# EAGLE schematic Tracksoar v2  (EAGLE 9.0.0)
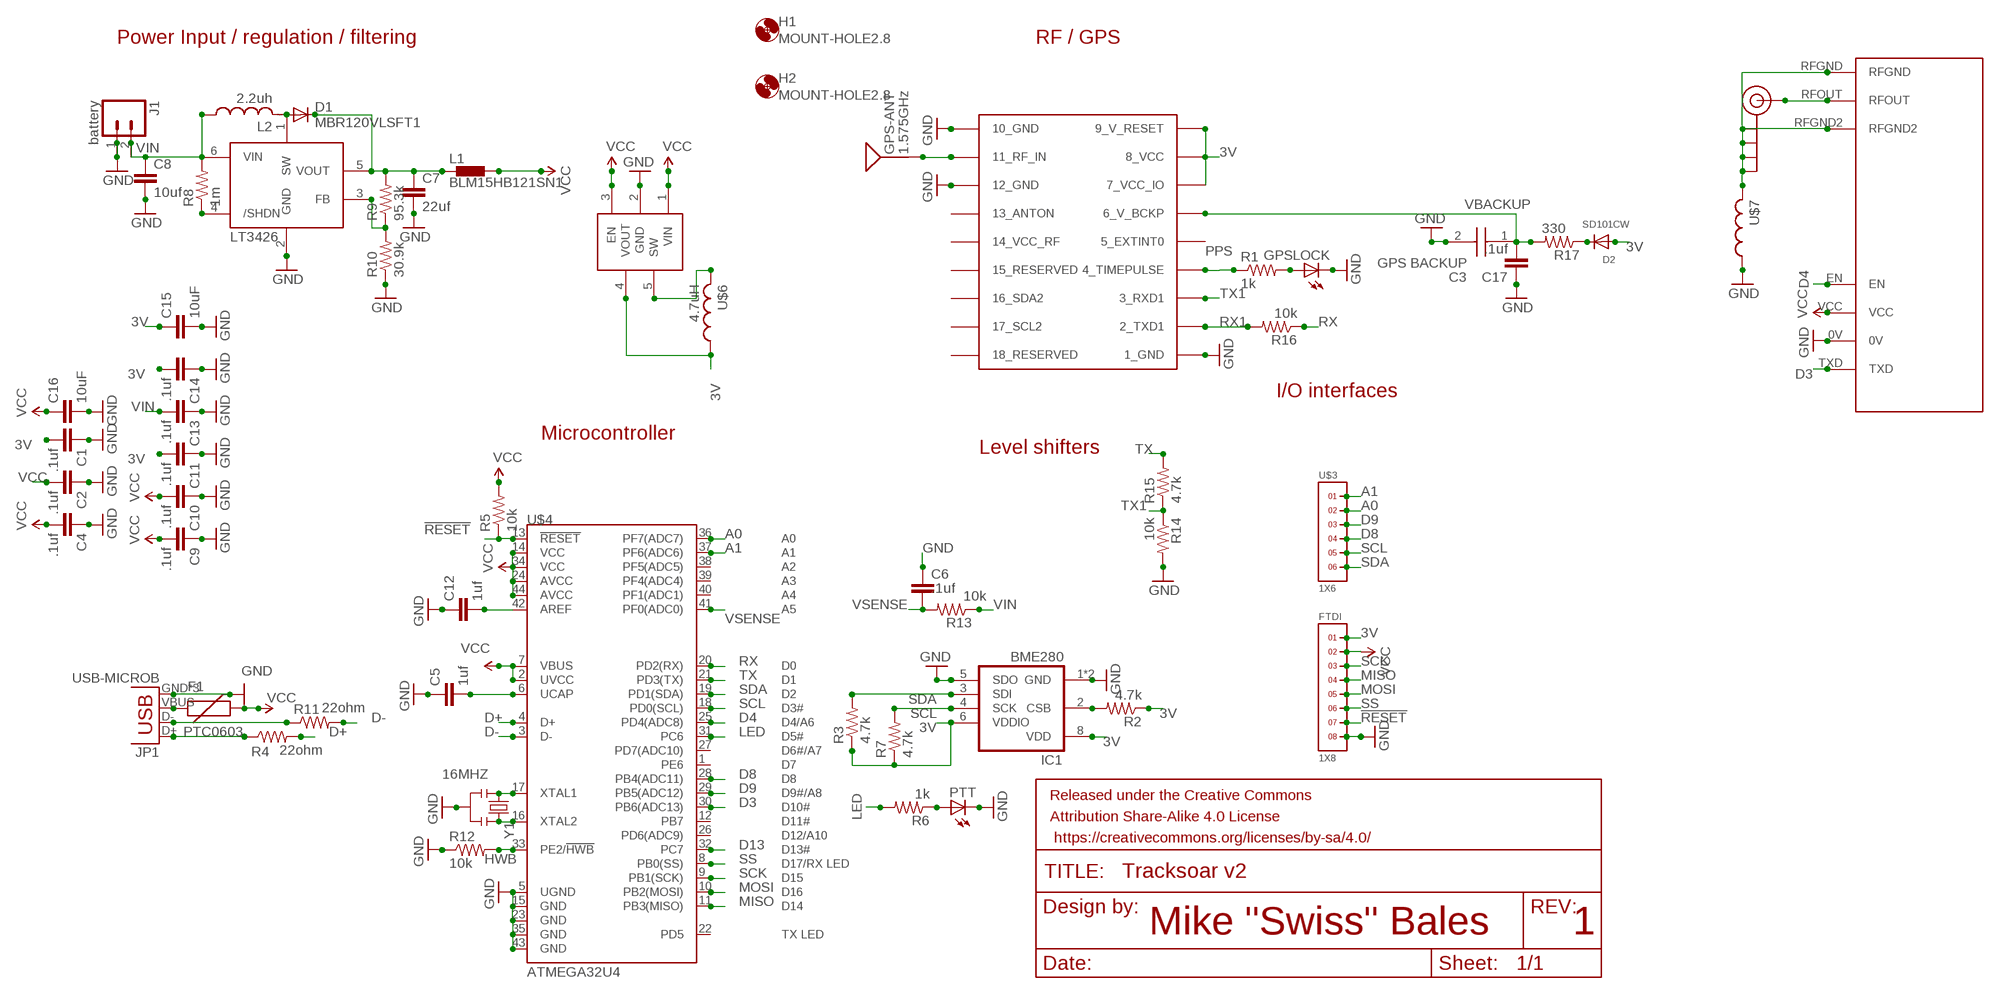
[diagram p0: schematic, sheet 1]

## Parts
C1  .1uf  CAP0402-CAP  [0402-CAP]
C2  .1uf  CAP0402-CAP  [0402-CAP]
C3  GPS BACKUP  DSK-3R3H204T614-H2L  [DSK-3R3H204T614-H2L]
C4  .1uf  CAP0402-CAP  [0402-CAP]
C5  1uf  CAP0402-CAP  [0402-CAP]
C6  .1uf  CAP0402-CAP  [0402-CAP]
C7  22uf  CAP0805  [0805]
C8  10uf  CAP0805  [0805]
C9  .1uf  CAP0402-CAP  [0402-CAP]
C10  .1uf  CAP0402-CAP  [0402-CAP]
C11  .1uf  CAP0402-CAP  [0402-CAP]
C12  1uf  CAP0402-CAP  [0402-CAP]
C13  .1uf  CAP0402-CAP  [0402-CAP]
C14  .1uf  CAP0402-CAP  [0402-CAP]
C15  10uF  10UF-0603-6.3V-20%  [0603]
C16  10uF  10UF-0603-6.3V-20%  [0603]
C17  .1uf  CAP0402-CAP  [0402-CAP]
D1  MBR120VLSFT1  DIODE-SOD123  [SOD123]
D2  SD101CW  DIODESOD-123  [SOD-123]
F1  PTC0603  [0603]
FRAME1  FRAME-LETTER  [CREATIVE_COMMONS]
FTDI  1X8  [1X8]
GPS-ANT  1.575GHz  ANTENNAGPS-2X7MM  [ANT-GPS-2X7MM]
GPSLOCK  LEDCHIP-LED0603  [CHIP-LED0603]
H1  MOUNT-HOLE2.8  [2,8]
H2  MOUNT-HOLE2.8  [2,8]
IC1  BME280  [BME280]
J1  battery  M02JST-PTH-2  [JST-2-PTH]
J$1  SMA_EDGE  [SMA-EDGE]
JP1  USB-MICROB  [USB-MICROB]
L1  BLM15HB121SN1  [0402]
L2  2.2uh  L-USL1812  [L1812]
LT3426  LT3426  [SOT23-6]
PTT  LEDCHIP-LED0603  [CHIP-LED0603]
R1  1k  R-US_R0402  [R0402]
R2  4.7k  R-US_R0402  [R0402]
R3  4.7k  R-US_R0402  [R0402]
R4  22ohm  R-US_R0402  [R0402]
R5  10k  R-US_R0402  [R0402]
R6  1k  R-US_R0402  [R0402]
R7  4.7k  R-US_R0402  [R0402]
R8  1m  R-US_R0402  [R0402]
R9  95.3k  R-US_R0402  [R0402]
R10  30.9k  R-US_R0402  [R0402]
R11  22ohm  R-US_R0402  [R0402]
R12  10k  R-US_R0402  [R0402]
R13  10k  R-US_R0402  [R0402]
R14  10k  R-US_R0402  [R0402]
R15  4.7k  R-US_R0402  [R0402]
R16  10k  R-US_R0402  [R0402]
R17  330  R-US_R0402  [R0402]
U$1  UBLOX_MAX  [UBLOX_MAX]
U$2  RADIOMETRIX-HX1  [RADIOMETRIX-HX1]
U$3  1X6  [1X6]
U$4  ATMEGA32U4  ATMEGA32U4QFN2  [QFN-44-NOPAD]
U$5  PAM2305  PAM2305-33SOT23-5  [DBV_R-PDSO-G5]
U$6  4.7uH  INDUCTOR_0805_N  [RESC0805_N]
U$7  INDUCTOR_0402_N  [RESC0402_N]
Y1  16MHZ  RESONATOR16MHZ  [RESONATOR-SMD]

## Nets
3V: C1.2 C11.2 C14.2 C15.1 D2.A FTDI.1 IC1.6(VDDIO) IC1.8(VDD) R2.1 R3.1 R7.1 U$1.7_VCC_IO U$1.8_VCC U$1.9_V_RESET U$5.4(VOUT) U$6.1
!RESET: FTDI.7 R5.1 U$4.13(!RESET)
A0: U$3.2 U$4.36(PF7(ADC7))
A1: U$3.1 U$4.37(PF6(ADC6))
D3: U$2.TXD U$4.30(PB6(ADC13))
D4: U$2.EN U$4.25(PD4(ADC8))
D8: U$3.4 U$4.28(PB4(ADC11))
D9: U$3.3 U$4.29(PB5(ADC12))
D13: U$4.32(PC7)
D+: R4.2 U$4.4(D+)
D-: R11.2 U$4.3(D-)
GND: C1.1 C2.1 C3.2(-) C4.1 C5.1 C6.1 C7.2 C8.2 C9.1 C10.1 C11.1 C12.1 C13.1 C14.1 C15.2 C16.2 C17.1 FTDI.8 GPSLOCK.C IC1.1(GND) IC1.5(SDO) IC1.7(GND) J1.1 JP1.GND JP1.MT1(GND) JP1.MT2(GND) LT3426.2(GND) PTT.C R10.1 R12.1 R14.2 U$1.1_GND U$1.10_GND U$1.12_GND U$2.0V U$4.5(UGND) U$4.15(GND) U$4.23(GND) U$4.35(GND) U$4.43(GND) U$5.2(GND) U$7.1 Y1.2
HWB: R12.2 U$4.33(PE2/!HWB)
LED: R6.2 U$4.31(PC6)
MISO: FTDI.4 U$4.11(PB3(MISO))
MOSI: FTDI.5 U$4.10(PB2(MOSI))
N$1: J$1.SIG(SIGNAL) U$2.RFOUT
N$2: IC1.2(CSB) R2.2
N$3: GPSLOCK.A R1.2
N$6: GPS-ANT.1(SIGNAL) U$1.11_RF_IN
N$7: JP1.D- R11.1
N$8: JP1.D+ R4.1
N$9: D1.A L2.2 LT3426.1(SW)
N$12: LT3426.4(/SHDN) R8.1
N$13: LT3426.3(FB) R9.1 R10.2
N$14: F1.1 JP1.VBUS
N$17: C12.2 U$4.42(AREF)
N$19: C7.1 D1.C L1.1 LT3426.5(VOUT) R9.2
N$20: C5.2 U$4.6(UCAP)
N$21: U$5.5(SW) U$6.2
N$22: D2.C R17.1
N$27: PTT.A R6.1
PPS: R1.1 U$1.4_TIMEPULSE
RFGND: J$1.GND@0(GND) J$1.GND@1(GND) J$1.GND@2(GND) J$1.GND@3(GND) U$2.RFGND U$2.RFGND2 U$7.2
RX: R16.1 U$4.20(PD2(RX))
RX1: R16.2 U$1.2_TXD1
SCK: FTDI.3 U$4.9(PB1(SCK))
SCL: IC1.4(SCK) R7.2 U$3.5 U$4.18(PD0(SCL))
SDA: IC1.3(SDI) R3.2 U$3.6 U$4.19(PD1(SDA))
SS: FTDI.6 U$4.8(PB0(SS))
TX: R15.2 U$4.21(PD3(TX))
TX1: R14.1 R15.1 U$1.3_RXD1
VBACKUP: C3.1(+) C17.2 R17.2 U$1.6_V_BCKP
VCC: C2.2 C4.2 C9.2 C10.2 C16.1 F1.2 FTDI.2 L1.2 R5.2 U$2.VCC U$4.2(UVCC) U$4.7(VBUS) U$4.14(VCC) U$4.24(AVCC) U$4.34(VCC) U$4.44(AVCC) U$5.1(VIN) U$5.3(EN)
VIN: C8.1 C13.2 J1.2 L2.1 LT3426.6(VIN) R8.2 R13.1
VSENSE: C6.2 R13.2 U$4.41(PF0(ADC0))
XTAL1: U$4.17(XTAL1) Y1.1
XTAL2: U$4.16(XTAL2) Y1.3
Unconnected: U$1.5_EXTINT0 U$1.13_ANTON U$1.14_VCC_RF U$1.15_RESERVED U$1.16_SDA2 U$1.17_SCL2 U$1.18_RESERVED U$4.1(PE6) U$4.12(PB7) U$4.22(PD5) U$4.26(PD6(ADC9)) U$4.27(PD7(ADC10)) U$4.38(PF5(ADC5)) U$4.39(PF4(ADC4)) U$4.40(PF1(ADC1))

## Notes on the sheet
- Power Input / regulation / filtering | RF / GPS
- I/O interfaces
- Microcontroller
- Level shifters
- Mike "Swiss" Bales | 1

## Library data of the parts
C1 C2 C4 C5 C7-C14 C17 = SparkFun-Capacitors:CAP: Capacitor Standard 0603 ceramic capacitor, and 0.1" leaded capacitor.
C3 = DSK-3R3H204T614-H2L:DSK-3R3H204T614-H2L: Coin cell capacitor Source: Datasheet <http://www.elna.co.jp/en/capacitor/double_layer/catalog/pdf/ds_e.pdf>; ARROW_PART_NUMBER: DSK-3R3H204T614-H2L; DESCRIPTION: Coin cell capacitor; HEIGHT: mm; MANUFACTURER_NAME: Elna; MANUFACTURER_PART_NUMBER: DSK-3R3H204T614-H2L
C6 = SparkFun-Passives:CAP: Capacitor Standard 0603 ceramic capacitor, and 0.1" leaded capacitor.
C15 C16 = SparkFun-Capacitors:10UF: 10.0µF ceramic capacitors A capacitor is a passive two-terminal electrical component used to store electrical energy temporarily in an electric field.; PROD_ID: CAP-11015
D1 = diode:DIODE-: DIODE
D2 = adafruit:DIODE: Diode SMADIODE - SMA Surface Mount Package 20V 1A Schottky Diode Digikey: 641-1014-6-ND DO-1N4148 - Through Hole Small Current Diode SOD-123 20V 1 A (.5mV Vf) Schottky Diode - Digikey: MBRX120TPMSCT-ND SOD-323 10V 570mA (.38mV Vf, 3ns) Schottky Diode - Digikey: ZLLS410CT-ND SOD-523 30V 30mA Schottky Diode (RB751S-40TE61) - Digikey: RB751S-40TE61CT-ND SOT23-R/W - SOT23 Package (R = Solder Paste/Reflow Ovens, W = Hand-Soldering) BAT54Film 40V 300mA - Digikey: 497-7162-1-ND
F1 = SparkFun-PowerIC:PTC: Resettable Fuse PTC Resettable Fuse. Spark Fun Electronics SKU : COM-08357
FRAME1 = SparkFun-Aesthetics:FRAME-LETTER: Schematic Frame Standard 8.5x11 US Letter frame
FTDI = headers(2mm):1X8
GPS-ANT = SparkFun-GPS:ANTENNA: Single-ended Antennae 1.575GHz antennae with just one terminal. These are all chip antennae. 1575MHz (GPS) Antennae ANT-GPS-2X7MM - 2.0 x 7.0 mm chip antenna. (SparkFun Product <https://www.sparkfun.com/products/9131>) ANT-GPS-2X8MM - 2.0 x 8.0 mm chip antenna. (SparkFun Product <https://www.sparkfun.com/products/8418>); PROD_ID: ANT-09087; SF_ID: GPS-09131
GPSLOCK PTT = adafruit:LED: LED OSRAM: - CHIPLED LG R971, LG N971, LY N971, LG Q971, LY Q971, LO R971, LY R971 LH N974, LH R974 LS Q976, LO Q976, LY Q976 LO Q996 - Hyper CHIPLED LW Q18S LB Q993, LB Q99A, LB R99A - SideLED LS A670, LO A670, LY A670, LG A670, LP A670 LB A673, LV A673, LT A673, LW A673 LH A674 LY A675 LS A676, LA A676, LO A676, LY A676, LW A676 LS A679, LY A679, LG A679 - Hyper Micro SIDELED® LS Y876, LA Y876, LO Y876, LY Y876 LT Y87S - SmartLED LW L88C, LW L88S LB L89C, LB L89S, LG L890 LS L89K, LO L89K, LY L89K LS L896, LA L896, LO L896, LY L896 - TOPLED LS T670, LO T670, LY T670, LG T670, LP T670 LSG T670, LSP T670, LSY T670, LOP T670, LYG T670 LG T671, LOG T671, LSG T671 LB T673, LV T673, LT T673, LW T673 LH T674 LS T676, LA T676, LO T676, LY T676, LB T676, LH T676, LSB T676, LW T676 LB T67C, LV T67C, LT T67C, LS T67K, LO T67K, LY T67K, LW E67C LS E67B, LA E67B, LO E67B, LY E67B, LB E67C, LV E67C, LT E67C LW T67C LS T679, LY T679, LG T679 LS T770, LO T770, LY T770, LG T770, LP T770 LB T773, LV T773, LT T773, LW T773 LH T774 LS E675, LA E675, LY E675, LS T675 LS T776, LA T776, LO T776, LY T776, LB T776 LHGB T686 LT T68C, LB T68C - Hyper Mini TOPLED® LB M676 - Mini TOPLED Santana® LG M470 LS M47K, LO M47K, LY M47K Source: http://www.osram.convergy.de/
H1 H2 = holes:MOUNT-HOLE: MOUNTING HOLE with drill center marker
IC1 = bosch-bme280:BME280: DIGITAL HUMIDITY, PRESSURE AND TEMPERATURE SENSOR * Digital interface I²C (up to 3.4 MHz) and SPI (3 and 4 wire, up to 10 MHz)* Supply voltage VDD main supply voltage range: 1.71 V to 3.6 V*VDDIO interface voltage range: 1.2 V to 3.6 V Operating range -40…+85 °C, 0…100 % rel. humidity, 300…1100 hPa The library has been designed by Richard Magdycz <https://www.facebook.com/groups/eaglecadsoftUK>
J1 = SparkFun-Connectors:M02: Standard 2-pin 0.1" header. Use with - straight break away headers ( PRT-00116) - right angle break away headers (PRT-00553) - swiss pins (PRT-00743) - machine pins (PRT-00117) - female headers (PRT-00115) Molex polarized connector foot print use with: PRT-08233 with associated crimp pins and housings. 2.54_SCREWTERM for use with PRT-10571. 3.5mm Screw Terminal footprints for PRT-08084 5mm Screw Terminal footprints for use with PRT-08432; PROD_ID: CONN-09863; SKU: PRT-09914
J$1 = SparkFun-Connectors:SMA_EDGE: SMA Antenna Connector End launch SMA connector. The paste layer has been removed so that the connector can be hand soldered onto the board after reflow.
JP1 = SparkFun-Connectors:USB: USB Connectors USB-B-PTH is fully proven SKU : PRT-00139/CONN-08278 USB-miniB is fully proven SKU : PRT-00587 USB-A-PCB is untested. USB-A-H is throughly reviewed, but untested. Spark Fun Electronics SKU : PRT-00437 USB-B-SMT is throughly reviewed, but untested. Needs silkscreen touching up. USB-A-S has not been used/tested USB-MB-H has not been used/tested USB-MICROB has been used. CONN-09505; PROD_ID: CONN-09505
L1 = inductors:BLM15H: EMIFIL (R) Chip Ferrite Bead for GHz Noise Source: http://www.murata.com/ Ferrite Bead BLM15H.pdf
L2 = resistor:L-US: INDUCTOR, American symbol
LT3426 = adafruit:LT3426: LT3426 1.2MHz, 2A boost converter in SOT-23 http://www.linear.com/pc/productDetail.jsp?navId=H0,C1,C1003,C1042,C1031,C1061,P8430 (Linear website)
R1-R17 = adafruit:R-US_: RESISTOR, American symbol
U$1 = Ava:UBLOX_MAX: UBLOX MAX
U$2 = Ava:RADIOMETRIX-HX1
U$3 = headers(2mm):1X6
U$4 = SparkFun-DigitalIC:ATMEGA32U4: Atmel 44-pin 8-bit Microcontroller with 32KBytes of ISP Flash and USB Controller
U$5 = PAM2305-33:PAM2305-33
U$6 U$7 = Nordic_nRF:INDUCTOR: Generic chip inductor
Y1 = SparkFun-FreqCtrl:RESONATOR: Resonator Small SMD resonator. Used, eg, on the Arduino Pro/ Pro Mini boards. 8MHz- XTAL-08895 16MHz- XTAL-08900; PROD_ID: XTAL-08900